# EAGLE design SparkFun_Micro_6DoF_LSM6DSV16X (EAGLE 9.6.2)
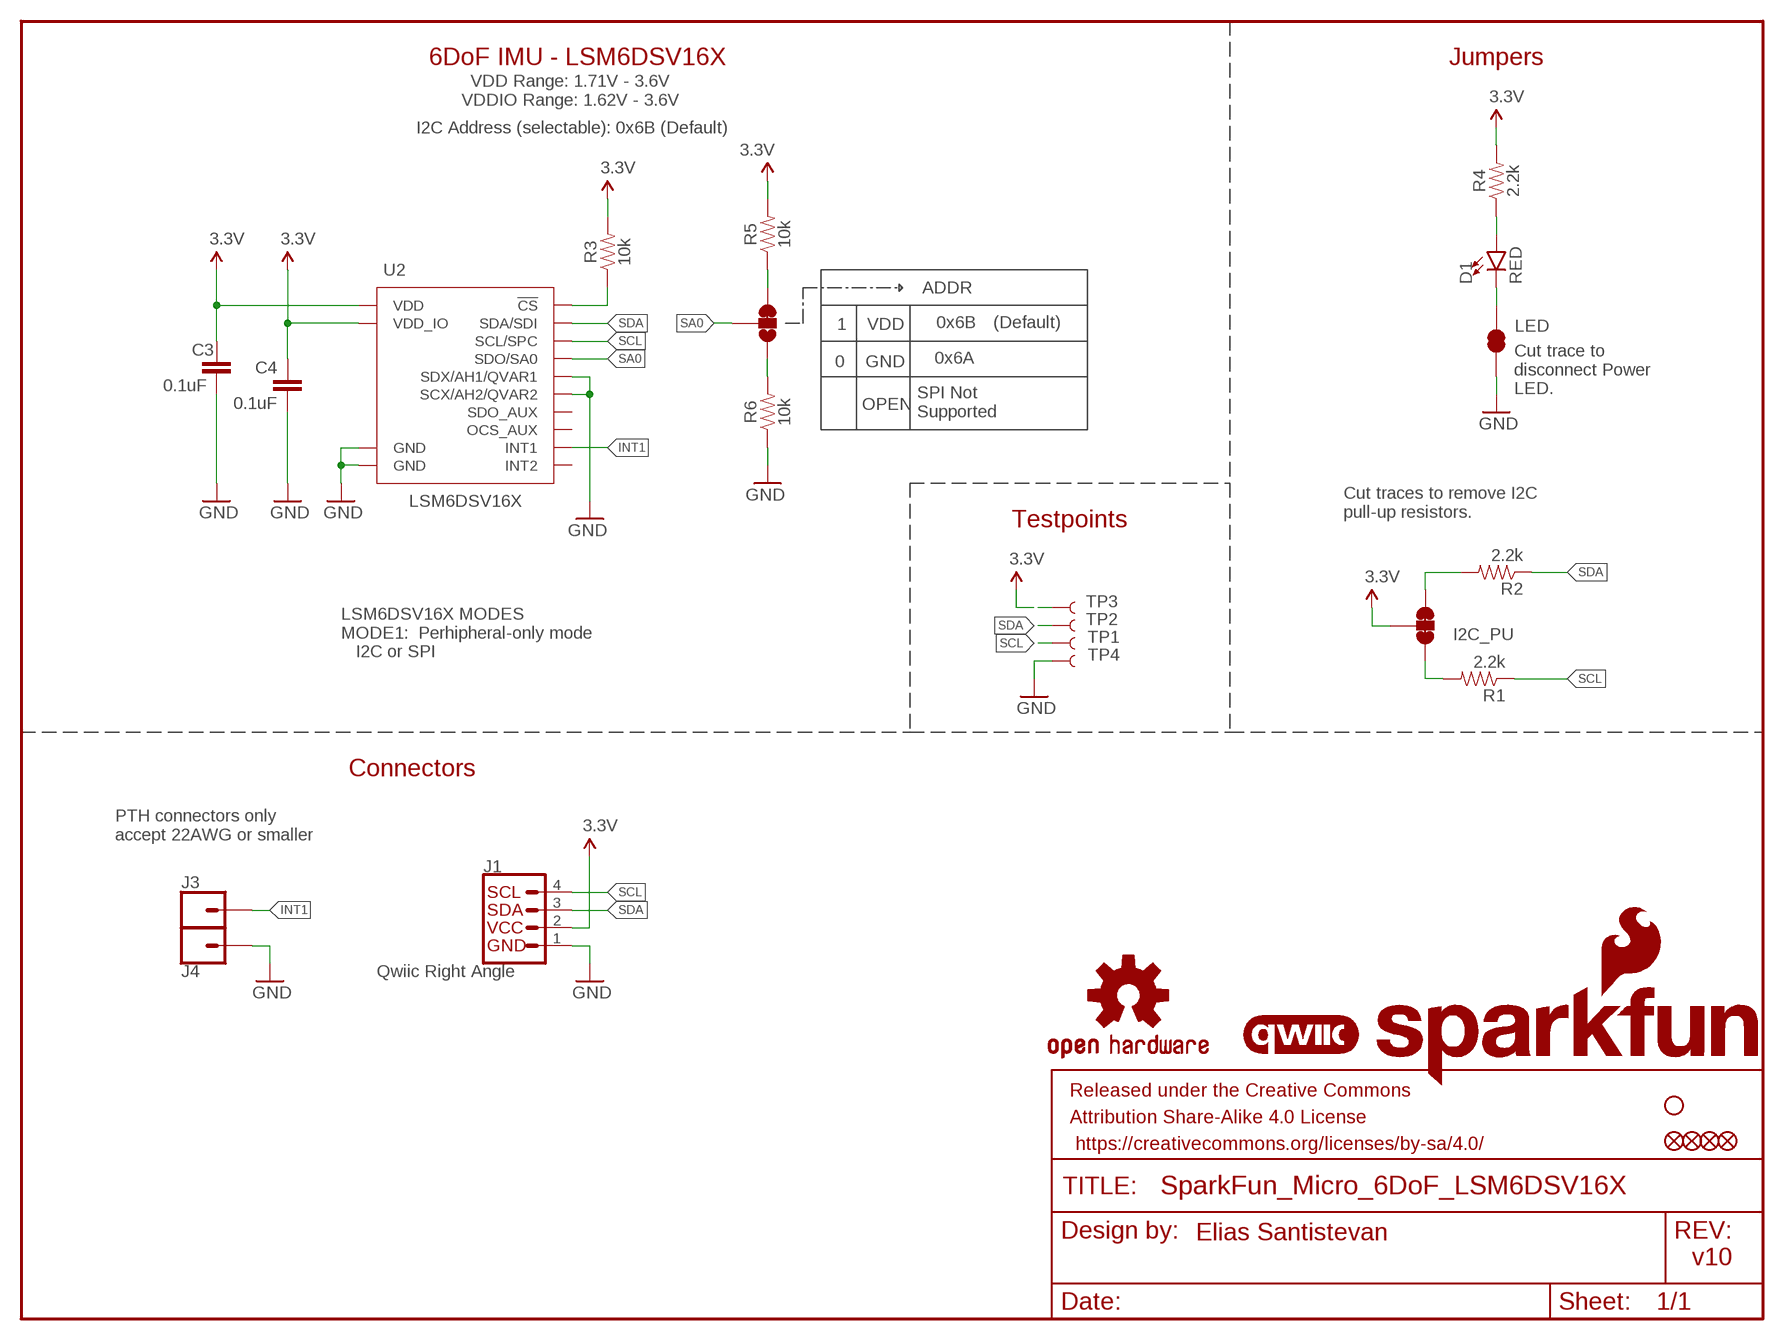
[diagram p0: schematic, sheet 1]

## Parts
ADDR  JUMPER-SMT_3_1-NC_TRACE_SILK  [SMT-JUMPER_3_1-NC_TRACE_SILK]
C3  0.1uF  0.1UF-0402T-6.3V-10%-X7R  [0402-TIGHT]
C4  0.1uF  0.1UF-0402T-6.3V-10%-X7R  [0402-TIGHT]
D1  RED  LED-RED_0402  [LED-0402]
FD1  FIDUCIALUFIDUCIAL  [FIDUCIAL-MICRO]
FD2  FIDUCIALUFIDUCIAL  [FIDUCIAL-MICRO]
FID1  FIDUCIALUFIDUCIAL  [FIDUCIAL-MICRO]
FID2  FIDUCIALUFIDUCIAL  [FIDUCIAL-MICRO]
FRAME1  FRAME-LETTER  [CREATIVE_COMMONS]
I2C_PU  S_MODE  JUMPER-SMT_3_2-NC_TRACE_SILK  [SMT-JUMPER_3_2-NC_TRACE_SILK]
J1  Qwiic Right Angle  I2C_STANDARDQWIIC  [JST04_1MM_RA]
J3  CONN_01_1MM  [1X01_1MM_NO_SILK]
J4  CONN_01_1MM  [1X01_1MM_NO_SILK]
LED  JUMPER-SMT_2_NC_TRACE_SILK  [SMT-JUMPER_2_NC_TRACE_SILK]
LOGO1  QWIIC_LOGO_3MM  [QWIIC_3MM]
LOGO2  OSHW-LOGOMINI  [OSHW-LOGO-MINI]
LOGO3  SFE_LOGO_NAME_FLAMEBLANK  [BLANK]
R1  2.2k  2.2KOHM-0402T-1/16W-1%  [0402-TIGHT]
R2  2.2k  2.2KOHM-0402T-1/16W-1%  [0402-TIGHT]
R3  10k  10KOHM-0402T-1/16W-1%  [0402-TIGHT]
R4  2.2k  2.2KOHM-0402T-1/16W-1%  [0402-TIGHT]
R5  10k  10KOHM-0402T-1/16W-1%  [0402-TIGHT]
R6  10k  10KOHM-0402T-1/16W-1%  [0402-TIGHT]
STANDOFF1  STAND-OFFTIGHT  [STAND-OFF-TIGHT]
TP1  TEST-POINT3  [PAD.03X.03]
TP2  TEST-POINT3  [PAD.03X.03]
TP3  TEST-POINT3  [PAD.03X.03]
TP4  TEST-POINT3  [PAD.03X.03]
U2  LSM6DSV16X  [LGA-14L]

## Nets
3.3V: C3.1 C4.1 I2C_PU.2 J1.2 R3.2 R4.2 R5.2 TP3.1 U2.P5(VDD_IO) U2.P8(VDD)
GND: C3.2 C4.2 J1.1 J4.1 LED.1 R6.1 TP4.1 U2.P2(SDX/AH1/QVAR1) U2.P3(SCX/AH2/QVAR2) U2.P6(GND) U2.P7(GND)
INT1: J3.1 U2.P4(INT1)
N$1: ADDR.3 R5.1
N$2: D1.A R4.1
N$3: D1.C LED.2
N$4: R3.1 U2.P12(!CS!)
N$5: I2C_PU.1 R1.2
N$6: I2C_PU.3 R2.2
N$7: ADDR.1 R6.2
SA0: ADDR.2 U2.P1(SDO/SA0)
SCL: J1.4 R1.1 TP1.1 U2.P13(SCL/SPC)
SDA: J1.3 R2.1 TP2.1 U2.P14(SDA/SDI)
Unconnected: U2.P9(INT2) U2.P10(OCS_AUX) U2.P11(SDO_AUX)

## Notes on the sheet
- 6DoF IMU - LSM6DSV16X | Jumpers
- VDD Range: 1.71V - 3.6V
  VDDIO Range: 1.62V - 3.6V
- I2C Address (selectable): 0x6B (Default)
- 1 | VDD | 0x6B | (Default)
- 0 | GND | 0x6A
- Cut trace to
  disconnect Power
  LED.
- OPEN
- SPI Not
  Supported
- Cut traces to remove I2C
  pull-up resistors.
- Testpoints
- LSM6DSV16X MODES
  MODE1:  Perhipheral-only mode
     I2C or SPI
- Connectors
- PTH connectors only 
  accept 22AWG or smaller
- Elias Santistevan
- v10

## Library data of the parts
ADDR = SparkFun-Jumpers:JUMPER-SMT_3_1-NC_TRACE: Normally closed trace jumper (1 of 2 connections) This jumper has a trace between two pads so it's normally closed (NC). The other connection is normally open (NO). Use a razor knife to open the connection. For best results follow the IPC guidelines for cutting traces: Cutout at least 0.063 mm (0.005 in). Remove all loose material to clean up the cut area. Seal the cut with an approved epoxy. Reapply solder to reclose the connection, or to close the NO connection.
C3 C4 = SparkFun-Capacitors:0.1UF: 0.1µF ceramic capacitors A capacitor is a passive two-terminal electrical component used to store electrical energy temporarily in an electric field.; PROD_ID: CAP-14993
D1 = SparkFun-LED:LED-RED: Red SMD LED Used in manufacturing of most products at SparkFun Packages: 0603 - KB - KingBright (DIO-17976) SMD 0603 package [Datasheet] <https://www.kingbrightusa.com/images/catalog/SPEC/APT1608SURCK.pdf> 0603 - (DIO-00819, has gone EOL) SMD 0603 package 0603 SMART - SMD 0603 SMART package ( more efficient and expensive)[Product Link] <http://www.osram-os.com/Graphics/XPic2/00077099_0.pdf> 1206 - SMD1206 package [Product Link] <https://www.sparkfun.com/datasheets/DevTools/LilyPad/Q150OVS4.pdff> SparkFun Products: Pro Mini 328 -5V <https://www.sparkfun.com/products/821> RedBoard <https://www.sparkfun.com/products/12757> IOIO-OTG <https://www.sparkfun.com/products/13613>; PROD_ID: DIO-16757
FD1 FD2 FID1 FID2 = SparkFun-Aesthetics:FIDUCIAL: Fiducial Alignment Points Point-of-reference for pick-and-place machines and other optical instruments.
FRAME1 = SparkFun-Aesthetics:FRAME-LETTER: Schematic Frame - Letter Standard 8.5x11 US Letter frame; DESIGNER: Elias Santistevan
I2C_PU = SparkFun-Jumpers:JUMPER-SMT_3_2-NC_TRACE: Normally closed trace jumper (2 of 2 connections) This jumper has a trace between all three pads so they are normally closed (NC). Use a razor knife to open the connection(s). For best results follow the IPC guidelines for cutting traces: Cutout at least 0.063 mm (0.005 in). Remove all loose material to clean up the cut area. Seal the cut with an approved epoxy. Reapply solder to reclose the connection(s).
J1 = SparkFun-Connectors:I2C_STANDARD: SparkFun I2C Standard Pinout Header SparkFun has standardized on a pinout for all I2C based sensor breakouts. This pinout allows I2C boards to be plugged directly into the headers on Arduino Uno compatible boards, and to be daisy chained easily. Example SparkFun Products: SparkFun Atmospheric Sensor Breakout - BME280 <https://www.sparkfun.com/products/13676> SparkFun Altitude/Pressure Sensor Breakout - MPL3115A2 <https://www.sparkfun.com/products/11084> SparkFun TOF Range Finder Sensor - VL6180 <https://www.sparkfun.com/products/12785>; PROD_ID: CONN-13694
J3 J4 = SparkFun-Connectors:CONN_01: Single connection point. Often used as Generic Header-pin footprint for 0.1 inch spaced/style header connections On any of the 0.1 inch spaced packages, you can populate with these: Break Away Headers - Straight <https://www.sparkfun.com/products/116> (PRT-00116) Break Away Male Headers - Right Angle <https://www.sparkfun.com/products/553> (PRT-00553) Female Headers <https://www.sparkfun.com/products/115> (PRT-00115) Break Away Headers - Machine Pin <https://www.sparkfun.com/products/117> (PRT-00117) Break Away Female Headers - Swiss Machine Pin <https://www.sparkfun.com/products/743> (PRT-00743) This device is also useful as a general connection point to wire up your design to another part of your project. Our various solder wires solder well into these plated through hole pads. Hook-Up Wire - Assortment (Stranded, 22 AWG) <https://www.sparkfun.com/products/11375> (PRT-11375) Hook-Up Wire - Assortment (Solid Core, 22 AWG) <https://www.sparkfun.com/products/11367> (PRT-11367) View the entire wire category on our website here <https://www.sparkfun.com/categories/141> Special notes: SMTSO-256-ET is a "flush mount" nut for a 4-40 screw. We mostly use this on specialty testbeds; it is a nice way to connect hardware to your PCB at an adjustable hieght. Also note, the SNAP packages are for using a snappable style connector. We sell a baggie of snaps and they are also used on two LilyPad designs: Snap Assortment - 30 pack (male and female) <https://www.sparkfun.com/products/11347> (DEV-11347) LilyPad Arduino SimpleSnap <https://www.sparkfun.com/products/10941> (DEV-10941) LilyPad SimpleSnap Protoboard <https://www.sparkfun.com/products/10940> (DEV-10940)
LED = SparkFun-Jumpers:JUMPER-SMT_2_NC_TRACE: Normally closed trace jumper This jumper has a trace between two pads so it's normally closed (NC). Use a razor knife to open the connection. For best results follow the IPC guidelines for cutting traces: Cutout at least 0.063 mm (0.005 in). Remove all loose material to clean up the cut area. Seal the cut with an approved epoxy. Reapply solder to reclose the connection.
LOGO1 = SparkFun-Aesthetics:QWIIC_LOGO: Qwiic Logos for placement on schematic and PCB. The 5.5mm silk logo is best for placing next to Qwiic connector.
LOGO2 = SparkFun-Aesthetics:OSHW-LOGO: Open-Source Hardware (OSHW) Logo This logo indicates the piece of hardware it is found on incorporates a OSHW license and/or adheres to the definition of open source hardware found here: http://freedomdefined.org/OSHW
LOGO3 = SparkFun-Aesthetics:SFE_LOGO_NAME_FLAME: SparkFun Font Logo w/ Flame This is the SparkFun full logo. The logo on the schematic will always be the same size; the package variant is the height of the flame part of the logo. Default layer for the logo on the board is tSilk.
R1 R2 R4 = SparkFun-Resistors:2.2KOHM: 2.2kΩ resistor A resistor is a passive two-terminal electrical component that implements electrical resistance as a circuit element. Resistors act to reduce current flow, and, at the same time, act to lower voltage levels within circuits. - Wikipedia; PROD_ID: RES-14341
R3 R5 R6 = SparkFun-Resistors:10KOHM: 10kΩ resistor A resistor is a passive two-terminal electrical component that implements electrical resistance as a circuit element. Resistors act to reduce current flow, and, at the same time, act to lower voltage levels within circuits. - Wikipedia; PROD_ID: RES-14241
STANDOFF1 = SparkFun-Hardware:STAND-OFF: Stand Off Drill holes for mechanically mounting via screws, standoffs, etc. Note: Use the keepout ring to avoid running the screw head into surrounding components. Variant Overviews STAND-OFF - Mechanical footprint for a #4 phillips button head screw. STAND-OFF-TIGHT - Mechanical footprint for a #4 phillips button head screw, Example SparkFun Products Screw - Phillips Head (1/4", 4-40, 10 pack) <https://www.sparkfun.com/products/10453> (PRT-10453) Screw - Phillips Head (1/2", 4-40, 10 pack) <https://www.sparkfun.com/products/10452> (PRT-10452) Screw - Phillips Head (3/4", 4-40, 10 pack) <https://www.sparkfun.com/products/10451> (PRT-10451) Screw - Phillips Head (1", 4-40, 10 pack) <https://www.sparkfun.com/products/10450> (PRT-10450)
TP1-TP4 = SparkFun-Connectors:TEST-POINT: SparkFun Test Points Bare copper test points for troubleshooting or In-Circuit-Testing. These are used by our Production team for verifying production board runs using pogo-pins on test beds. SparkFun Products: SparkFun LSM9DS1 Breakout <https://www.sparkfun.com/products/13284> SparkFun PSOC <https://www.sparkfun.com/products/13714> SparkFun Load Cell Amplifier <https://www.sparkfun.com/products/13879>
U2 = lsm6dsv16x:LSM6DSV16X: STMicroelectronic's LSM6DSV16X 6DoF The LSM6DSV16X is a high-performance, low-power 6-axis IMU, featuring a 3-axis digital accelerometer and a 3-axis digital gyroscope, with a triple core for processing acceleration and angular rate data on three separate channels (user interface, OIS, and EIS) with dedicated configuration, processing, and filtering. The LSM6DSV16X enables processes in edge computing, leveraging embedded advanced dedicated features such as a finite state machine (FSM) for configurable motion tracking and a machine learning core (MLC) for contextual awareness with exportable AI features for IoT applications. The LSM6DSV16X embeds Qvar (electric charge variation detection) for user interface functions like tap, double tap, triple tap, long press, or L/R – R/L swipe. The LSM6DSV16X embeds an analog hub able to connect an external analog input and convert it to a digital signal for processing. Product Page <https://www.st.com/en/mems-and-sensors/lsm6dsv16x.html#overview>; PROD_ID: IC-17274

## Board
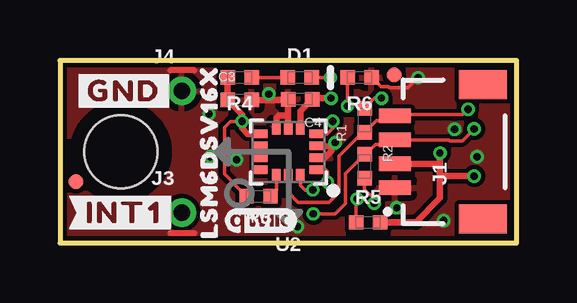
[diagram p1: board, top side]
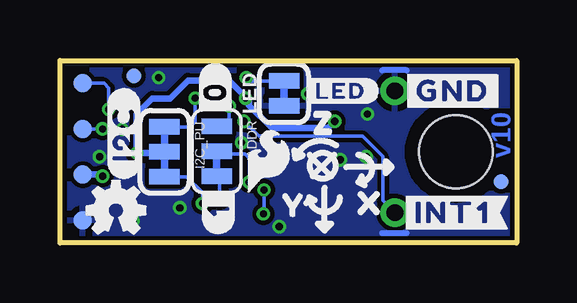
[diagram p2: board, bottom side, seen from below]

Size 19.05 x 7.62 mm. Coordinates in mm from the lower left corner, seen from the top.
Outline: 19.05,7.62 0,7.62 0,0 19.05,0 19.05,7.62
Copper layers (1*16): Top 0.035mm / dielectric 1.5mm / Bottom 0.035mm
Design rules "SparkFun-2-Layer-Minimum-JLCPCB": minimum track width 5mil, minimum drill 0.3mm, track to track 5mil, track to pad 5mil, pad to pad 5mil, via to via 5mil, smd to smd 5mil, copper to edge 7mil, drill to drill 7mil, minimum pad ring 5mil, minimum via ring 5mil, stop-mask expansion 2.5mil, vias tented up to drill 25mil, thermal gap 10mil
tRestrict: area 10.6,3.8 to 10.8,3.8

### Footprints (pad centres in the part's own frame; a part is rotated, then mirrored left to right if it is on the bottom)
SMT-JUMPER_3_1-NC_TRACE_SILK = smd 0.66 x 1.27: 1 -1.041,0; 2 0,0; 3 1.041,0
0402-TIGHT = smd 0.6 x 0.6: 1 -0.5,0; 2 0.5,0
LED-0402 = smd 0.6 x 0.6: A -0.5,0; C 0.5,0
FIDUCIAL-MICRO = smd 0.635 x 0.635: 1 0,0
SMT-JUMPER_3_2-NC_TRACE_SILK = smd 0.66 x 1.27: 1 -1.041,0; 2 0,0; 3 1.041,0
JST04_1MM_RA = smd 0.6 x 1.35: 1 -1.5,0; 2 -0.5,0; 3 0.5,0; 4 1.5,0 | smd 1.2 x 2: NC1 2.8,-3.675; NC2 -2.8,-3.675
1X01_1MM_NO_SILK = drill 0.7 pad 1.2: 1 0,0
SMT-JUMPER_2_NC_TRACE_SILK = smd 0.66 x 1.27: 1 -0.521,0; 2 0.521,0
STAND-OFF-TIGHT = hole 3.048: 0,0
PAD.03X.03 = smd 0.762 x 0.762: 1 0,0
LGA-14L = smd 0.575 x 0.35: P1 -1.163,0.75; P2 -1.163,0.25; P3 -1.163,-0.25; P4 -1.163,-0.75; P8 1.163,-0.75; P9 1.163,-0.25; P10 1.163,0.25; P11 1.163,0.75 | smd 0.35 x 0.575: P5 -0.5,-1; P6 0,-1; P7 0.5,-1; P12 0.5,1; P13 0,1; P14 -0.5,1

### Placement (x,y rotation side)
ADDR  12.52,3.84 270 bottom
C3  7.49,5.98 0 top
C4  10.02,6 180 top
D1  10.01,6.91 0 top
FD1  15.98,6.99 0 bottom
FD2  0.66,2.57 0 bottom
FID1  13.94,7.01 0 top
FID2  0.66,2.57 0 top
FRAME1  -21.59,-22.86 0 top  (outside the outline)
I2C_PU  14.69,3.81 270 bottom
J1  13.97,3.81 90 top
J3  5.08,1.27 0 top
J4  5.08,6.35 0 top
LED  9.7,6.25 90 bottom
LOGO1  8.38,0.94 0 top
LOGO2  16.71,1.38 0 bottom
LOGO3  -39.37,-15.24 0 top  (outside the outline)
R1  12.71,5.13 90 top
R2  12.71,3.2 270 top
R3  8.28,1.96 180 top
R4  7.49,6.91 180 top
R5  12.85,0.86 0 top
R6  12.5,6.91 180 top
STANDOFF1  2.54,3.81 0 top
TP1  18.1,6.67 270 bottom
TP2  18.1,4.76 0 bottom
TP3  18.1,2.86 0 bottom
TP4  18.1,0.95 0 bottom
U2  9.53,3.81 180 top
U$1  [#0#4]  12.57,6.35 90 bottom
U$2  [#1#4]  12.45,1.4 90 bottom
U$3  [#LED#2121]  7.34,6.35 0 bottom
U$4  [#GND#4]  2.67,6.35 0 top
U$5  [#INT1#0]  2.67,1.27 0 top
U$6  [LSM6DSV16X31]  6.22,3.81 90 top
U$7  [X2114]  6.1,1.65 0 bottom
U$8  [Y2115]  9.27,1.57 0 bottom
U$9  [Z2116]  8.03,5 0 bottom
U$10  [#GND#4]  2.67,6.35 0 bottom
U$11  [#INT1#2]  2.67,1.27 0 bottom
U$12  [#I2C#4]  16.38,4.57 90 bottom
U$29  [SFE_LOGO_FLAME_.1]  10.36,3.43 0 bottom

### Tracks (layer width: path | path; a pad name or v marks a point on that pad's centre or on a via)
3.3V  (via drill 0.3)
  Top 0.152: R3.2 6.86,2.88 6.86,4.83 7.11,5.08 v7.59,5.08
  Top 0.279: v15.85,3.76 15.85,3.38 | 15.85,3.38 15.85,2.79 | 15.85,2.79 15.85,1.88 14.83,0.86 R5.2 | U2.P8 7.83,4.56 7.59,4.79 v7.59,5.08 7.59,5.36 6.99,5.96 C3.1 R4.2 | v11.31,6.04 10.56,6.04 C4.1 10.03,5.5 U2.P5 | J1.2 15.78,3.31 15.85,3.38 | 15.85,2.79 v17.27,2.79
  Bottom 0.279: I2C_PU.2 14.74,3.76 v15.85,3.76 v15.84,3.77 15.84,5.39 15.2,6.03 14.46,6.03 13.72,6.78 11.99,6.78 11.31,6.1 v11.31,6.04 11.15,5.89 11.15,5.75 10.21,4.8 7.87,4.8 v7.59,5.08 | v17.27,2.79 17.34,2.86 TP3.1
GND  (via drill 0.3)
  Top 0.152: R6.1 13.38,6.53 13.69,6.53 13.73,6.49 14.52,6.49 v14.94,6.91
  Top 0.254: U2.P3 11.3,4.06 | U2.P2 11.03,3.56 11.3,3.83 11.3,4.06 | v11.48,4.19 11.43,4.19 11.3,4.06 | 5.61,7.21 4.6,7.21 | 5.61,0.41 4.6,0.41
  Top 0.279: C3.2 9.45,5.97 9.47,5.96 C4.2 9.52,5.41 | U2.P6 9.52,5.41 | 9.52,5.41 9.43,5.32 9.14,5.32 9.03,5.21 U2.P7
  Bottom 0.254: 4.6,0.41 5.61,0.41 | 4.6,7.21 5.61,7.21
  other vias: 14.05,1.47 9.91,0.69 6.22,5.38 16,0.94 17.4,3.61 7.37,3.48 16.46,4.75 8.71,6.22 6.27,3.61
  pour Bottom (isolate 0.178): 19.05,0 19.05,7.62 0,7.62 0,0
  pour Top (isolate 0.178, rank 2): 19.05,0 19.05,7.62 0,7.62 0,0
INT1  (via drill 0.3)
  Top 0.152: U2.P4 11.14,4.56 11.38,4.8 v11.38,5.08
  Bottom 0.152: v11.38,5.08 10.75,4.46 6.44,4.46 5.59,3.61 5.59,1.78 J3.1
N$1  (via drill 0.3)
  Top 0.152: R5.1 12.35,1.8 v12.39,1.84
  Bottom 0.152: v12.39,1.84 12.39,2.67 ADDR.3
N$2
  Top 0.152: D1.A R4.1
N$3  (via drill 0.3)
  Top 0.152: D1.C v11.28,6.91
  Bottom 0.152: v11.28,6.91 11.14,6.77 LED.2
N$4
  Top 0.152: U2.P12 9.03,2.2 R3.1
N$5  (via drill 0.3)
  Top 0.152: R1.2 13.12,6.04 v13.41,6.04
  Bottom 0.152: v13.41,6.04 13.41,5.05 13.61,4.85 I2C_PU.1
N$6  (via drill 0.3)
  Top 0.152: R2.2 12.71,2.24 13.11,1.84 v13.11,1.65
  Bottom 0.152: v13.11,1.65 13.11,2.11 13.77,2.77 I2C_PU.3
N$7  (via drill 0.3)
  Top 0.152: R6.2 12,5.72 v11.99,5.71
  Bottom 0.152: v11.99,5.71 11.99,5.02 12.13,4.88 ADDR.1
SA0  (via drill 0.3)
  Top 0.152: U2.P1 11.09,3.06 11.15,3 v11.15,2.54
  Bottom 0.152: v11.15,2.54 11.15,3.53 11.33,3.71 12.39,3.71 ADDR.2
SCL  (via drill 0.3)
  Top 0.152: v17.02,5.59 16.79,5.36 14.02,5.36 J1.4 13.77,5.11 13.2,5.11 12.72,4.63 R1.1 12.63,4.63 11.63,3.63 11.63,2.11 11.23,1.7 9.93,1.7 9.53,2.11 U2.P13
  Bottom 0.152: v17.02,5.59 17.02,6.48 17.21,6.67 TP1.1
SDA  (via drill 0.3)
  Top 0.152: v10.54,2.21 10.21,2.21 10.03,2.4 U2.P14 | v10.57,1.22 11.47,1.22 11.91,1.66 11.91,2.9 12.71,3.69 R2.1 12.75,3.7 13.16,4.11 13.77,4.11 J1.3 16.22,4.31 16.26,4.27 16.78,4.27 v17.27,4.76
  Bottom 0.152: v10.57,1.22 10.54,1.25 v10.54,2.21 | v17.27,4.76 TP2.1

### Text on the board
Bottom: v10
Measures: Units in Inches